# EasyEDA Pro project ph_module.eprj

# Schematic Schematic1
Board Name: Board1; Create Date: 2025-11-07; Page Name: P1; Project Name: ph模块; Schematic Name: Schematic1; Update Date: 2025-11-09; Company: 嘉立创EDA; Page Size: A4; Version: V1.0
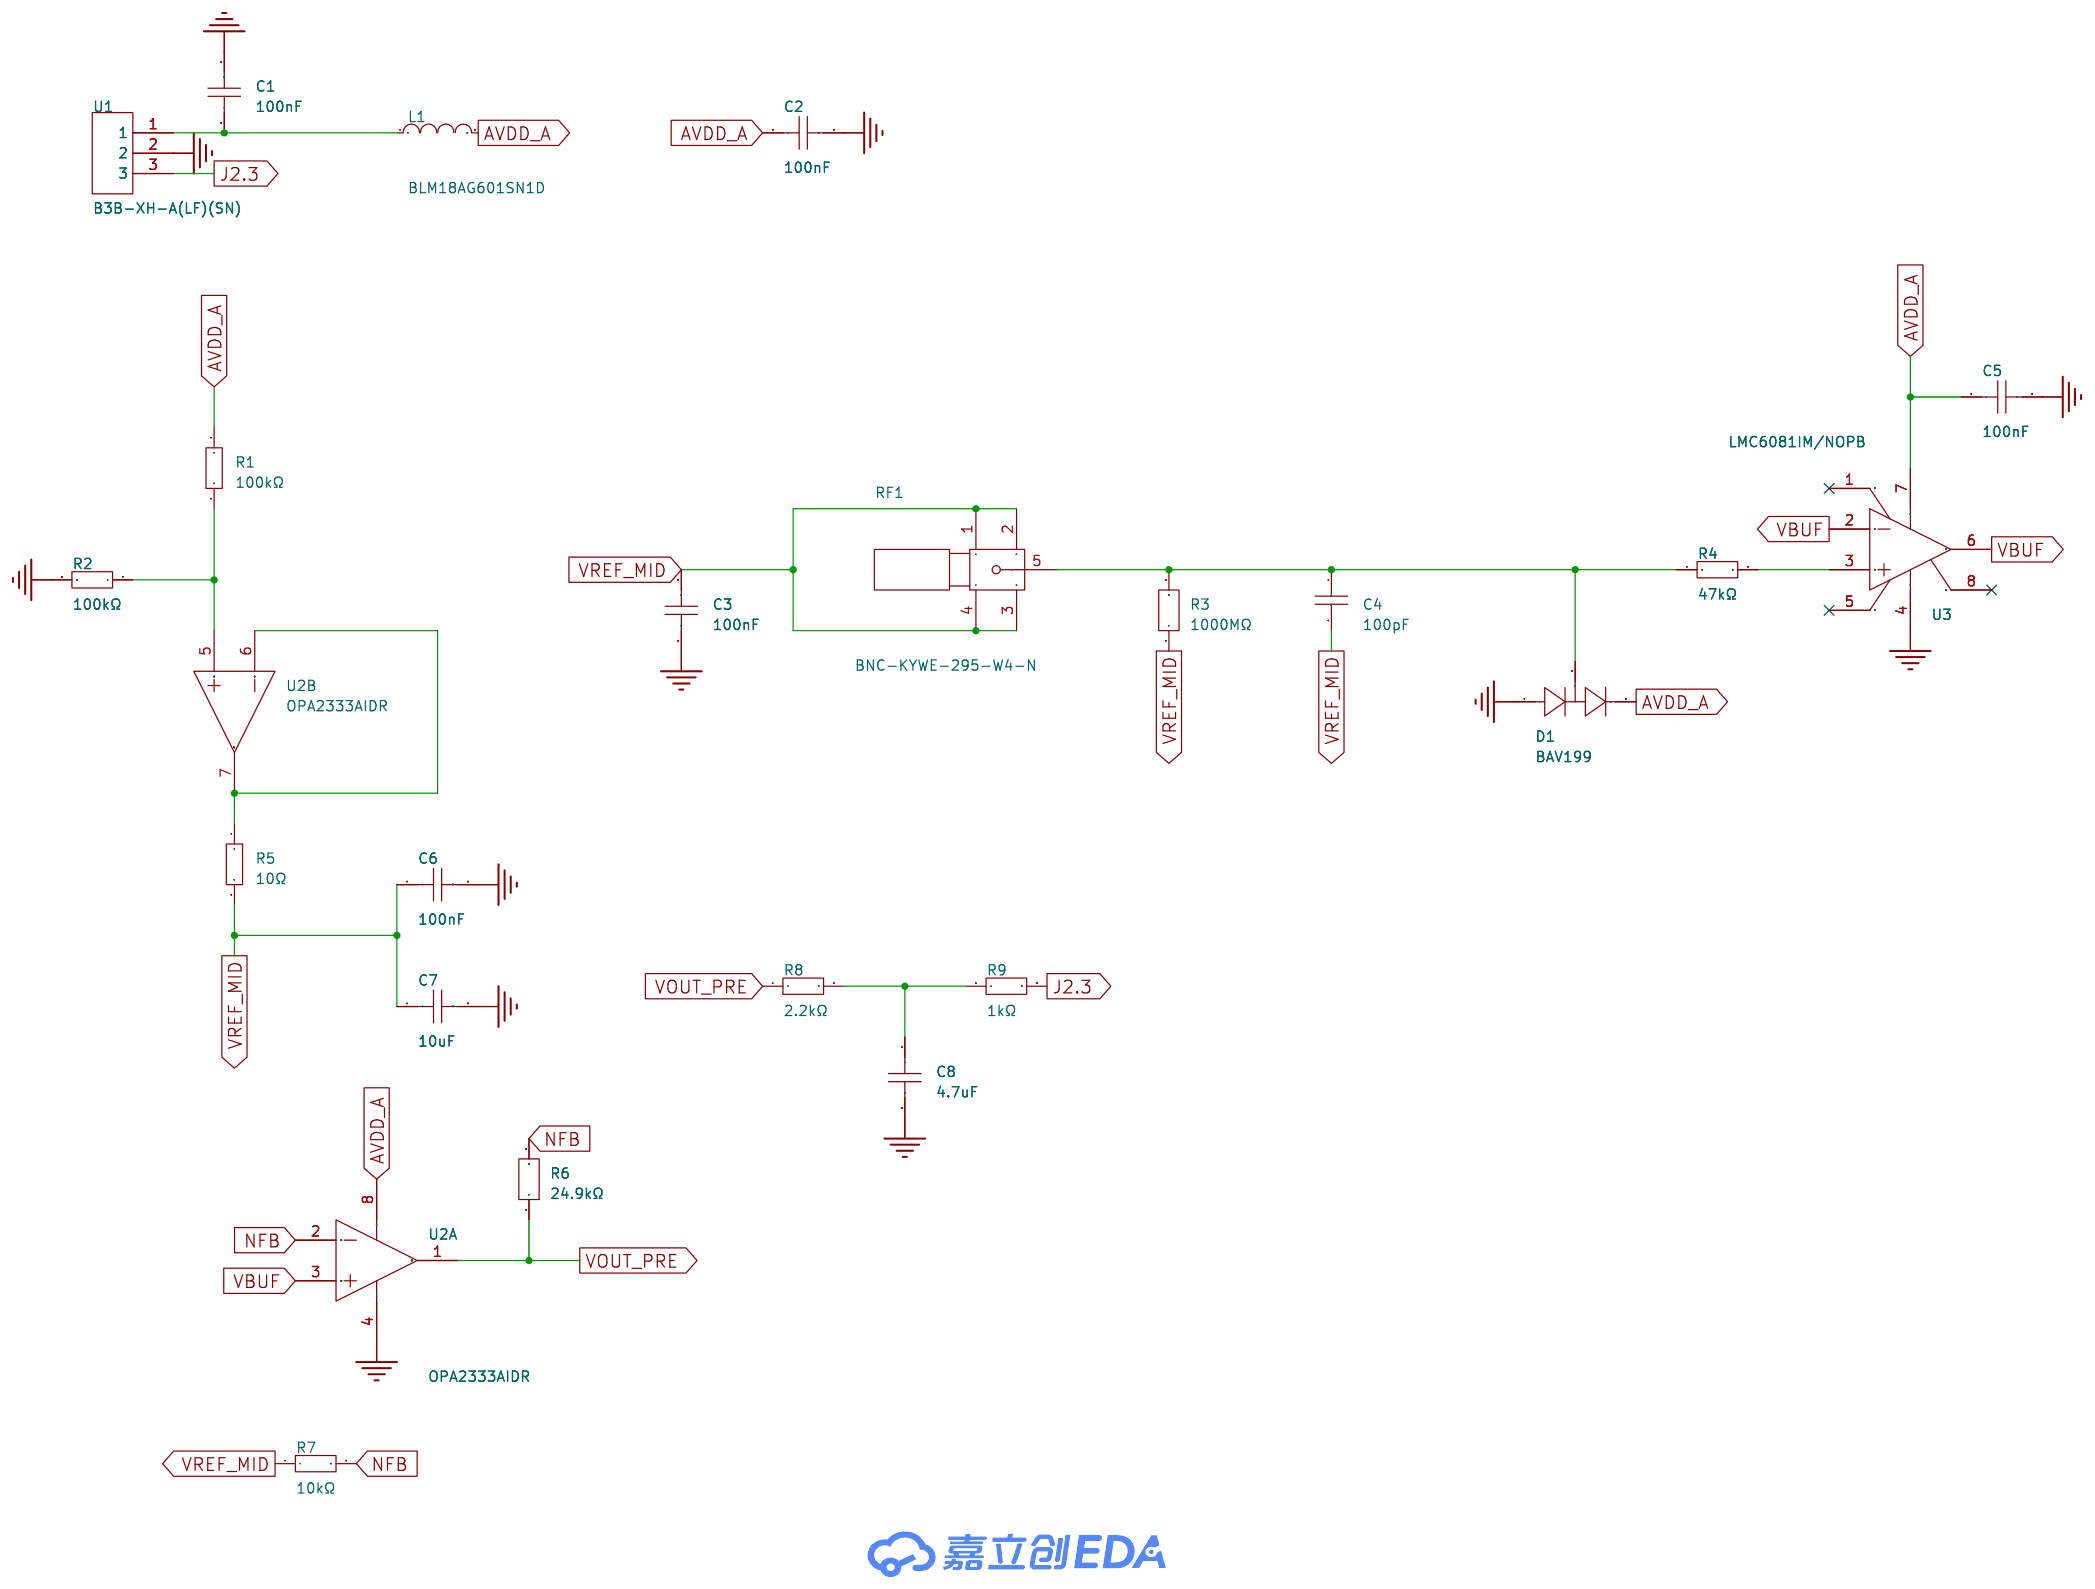
[diagram p0: schematic sheet]

## Parts
C1  100nF  [C0603]
C2  100nF  [C0603]
C3  100nF  [C0603]
C4  100pF  [C0603]
C5  100nF  [C0603]
C6  100nF  [C0603]
C7  10uF  [C0603]
C8  4.7uF  [C0603]
D1  BAV199  [SOT-23-3_L2.9-W1.3-P1.90-LS2.4-BR]
L1  BLM18AG601SN1D  [L0603]
R1  100kΩ  [R0603]
R2  100kΩ  [R0603]
R3  1000MΩ  [R1206]
R4  47kΩ  [R0603]
R5  10Ω  [R0603]
R6  24.9kΩ  [R0603]
R7  10kΩ  [R0603]
R8  2.2kΩ  [R0603]
R9  1kΩ  [R0603]
RF1  BNC-KYWE-295-W4-N  [BNC-TH_BNC-KYWE-295-W4-N]
U1  B3B-XH-A(LF)(SN)  [CONN-TH_3P-P2.50_A2501WV2-3P]
U2  OPA2333AIDR  [SOP-8_L4.9-W3.9-P1.27-LS6.0-BL]  (sections 1,2)
U3  LMC6081IM/NOPB  [SOIC-8_L4.9-W3.9-P1.27-LS6.0-BL]

## Library data of the parts
C1-C3 C5 C6 = CC0603KRX7R9BB104: LCSC Part Name: 100nF ±10% 50V; Supplier Part: C14663; Manufacturer: YAGEO(国巨); Supplier Footprint: 0603; Datasheet: https://item.szlcsc.com/datasheet/CC0603KRX7R9BB104/15331.html; Supplier: LCSC; Tolerance: ±10%; Voltage Rating: 50V; Temperature Coefficient: X7R
C4 = CL10C101JB8NNNC: LCSC Part Name: 100pF ±5% 50V; Supplier Part: C14858; Manufacturer: SAMSUNG(三星); Supplier Footprint: 0603; JLCPCB Part Class: 基础库; Datasheet: https://item.szlcsc.com/datasheet/CL10C101JB8NNNC/15530.html; Supplier: LCSC; Tolerance: ±5%; Voltage Rating: 50V; Temperature Coefficient: C0G
C7 = CL10A106KP8NNNC: LCSC Part Name: 10uF ±10% 10V; Supplier Part: C19702; Manufacturer: SAMSUNG(三星); Supplier Footprint: 0603; JLCPCB Part Class: 基础库; Datasheet: https://item.szlcsc.com/datasheet/CL10A106KP8NNNC/20411.html; Supplier: LCSC; Tolerance: ±10%; Voltage Rating: 10V; Temperature Coefficient: X5R
C8 = CL10A475KO8NNNC: LCSC Part Name: 4.7uF ±10% 16V; Supplier Part: C19666; Manufacturer: SAMSUNG(三星); Supplier Footprint: 0603; JLCPCB Part Class: 基础库; Datasheet: https://item.szlcsc.com/datasheet/CL10A475KO8NNNC/20375.html; Supplier: LCSC; Tolerance: ±10%; Voltage Rating: 16V; Temperature Coefficient: X5R
D1 = BAV199: Supplier Part: C699080; Manufacturer: YANGJIE(扬杰); Supplier Footprint: SOT-23(TO-236); JLCPCB Part Class: 扩展库; Datasheet: https://item.szlcsc.com/datasheet/BAV199/733772.html; Supplier: LCSC; Diode Configuration: 1对串联式; Voltage - Forward(Vf@If): 1.25V@150mA; Voltage - DC Reverse(Vr): 100V; Current - Rectified: 215mA; Pd - Power Dissipation: 250mW; Reverse Leakage Current (Ir): 5nA@75V; Reverse Recovery Time (trr): 3us; Non-Repetitive Peak Forward Surge Current: 4A
L1 = BLM18AG601SN1D: LCSC Part Name: 单路 0603磁珠 阻抗600Ω@100MHz; Supplier Part: C19330; Manufacturer: muRata(村田); Supplier Footprint: 0603; JLCPCB Part Class: 扩展库; Datasheet: https://item.szlcsc.com/datasheet/BLM18AG601SN1D/20038.html; Supplier: LCSC; Impedance @ Frequency: 600Ω@100MHz; Tolerance: ±25%; DC Resistance(DCR): 380mΩ; Current Rating: 500mA; Number of Circuits: 1; Operating Temperature: -55℃~+125℃
R1 R2 = 0603WAF1003T5E: LCSC Part Name: 100kΩ ±1% 100mW 厚膜电阻; Supplier Part: C25803; Manufacturer: UNI-ROYAL(厚声); Supplier Footprint: 0603; JLCPCB Part Class: 基础库; Datasheet: https://item.szlcsc.com/datasheet/0603WAF1003T5E/26546.html; Supplier: LCSC; Type: 厚膜电阻; Tolerance: ±1%; Power(Watts): 100mW; Voltage-Supply(Max): 75V; Temperature Coefficient: ±100ppm/℃; Operating Temperature: -55℃~+155℃
R3 = CRHV1206AF1G00FKE5: LCSC Part Name: 厚膜电阻 1000MΩ ±1% 300mW; Supplier Part: C844672; Manufacturer: VISHAY(威世); Supplier Footprint: 1206; JLCPCB Part Class: 扩展库; Datasheet: https://atta.szlcsc.com/upload/public/pdf/source/20221018/DEF225B2698C10BDB93B3063AAF38A59.pdf; Supplier: LCSC; Type: 厚膜电阻; Tolerance: ±1%; Power(Watts): 300mW; Temperature Coefficient: ±100ppm/℃; Operating Temperature Range: -55℃~+155℃
R4 = 0603WAF4702T5E: LCSC Part Name: 47kΩ ±1% 100mW 厚膜电阻; Supplier Part: C25819; Manufacturer: UNI-ROYAL(厚声); Supplier Footprint: 0603; JLCPCB Part Class: 基础库; Datasheet: https://item.szlcsc.com/datasheet/0603WAF4702T5E/26562.html; Supplier: LCSC; Type: 厚膜电阻; Tolerance: ±1%; Power(Watts): 100mW; Voltage-Supply(Max): 75V; Temperature Coefficient: ±100ppm/℃; Operating Temperature: -55℃~+155℃
R5 = 0603WAF100JT5E: LCSC Part Name: 10Ω ±1% 100mW 厚膜电阻; Supplier Part: C22859; Manufacturer: UNI-ROYAL(厚声); Supplier Footprint: 0603; Datasheet: https://item.szlcsc.com/datasheet/0603WAF100JT5E/23586.html; Supplier: LCSC; Type: 厚膜电阻; Tolerance: ±1%; Power(Watts): 100mW; Voltage-Supply(Max): 75V; Temperature Coefficient: ±400ppm/℃; Operating Temperature: -55℃~+155℃
R6 = FRC0603F2492TS: LCSC Part Name: 24.9kΩ ±1% 100mW 厚膜电阻; Supplier Part: C2930080; Manufacturer: FOJAN(富捷); Supplier Footprint: 0603; JLCPCB Part Class: 扩展库; Supplier: LCSC; Type: 厚膜电阻; Tolerance: ±1%; Power(Watts): 100mW; Voltage-Supply(Max): 75V; Temperature Coefficient: ±100ppm/℃; Operating Temperature: -55℃~+155℃
R7 = 0603WAF1002T5E: LCSC Part Name: 厚膜电阻 10kΩ ±1% 100mW; Supplier Part: C25804; Manufacturer: UNI-ROYAL(厚声); Supplier Footprint: 0603; JLCPCB Part Class: 基础库; Datasheet: https://item.szlcsc.com/datasheet/0603WAF1002T5E/26547.html; Supplier: LCSC; Type: 厚膜电阻; Tolerance: ±1%; Power(Watts): 100mW; Voltage-Supply(Max): 75V; Temperature Coefficient: ±100ppm/℃; Operating Temperature: -55℃~+155℃
R8 = 0603WAF2201T5E: LCSC Part Name: 2.2kΩ ±1% 100mW 厚膜电阻; Supplier Part: C4190; Manufacturer: UNI-ROYAL(厚声); Supplier Footprint: 0603; JLCPCB Part Class: 基础库; Datasheet: https://atta.szlcsc.com/upload/public/pdf/source/20200306/C422600_1E6D84923E4A46A82E41ADD87F860B5C.pdf; Supplier: LCSC; Type: 厚膜电阻; Tolerance: ±1%; Power(Watts): 100mW; Overload Voltage (Max): 75V; Temperature Coefficient: ±100ppm/℃; Operating Temperature Range: -55℃~+155℃
R9 = 0603WAF1001T5E: LCSC Part Name: 1kΩ ±1% 100mW 厚膜电阻; Supplier Part: C21190; Manufacturer: UNI-ROYAL(厚声); Supplier Footprint: 0603; JLCPCB Part Class: 基础库; Datasheet: https://atta.szlcsc.com/upload/public/pdf/source/20200306/C422600_1E6D84923E4A46A82E41ADD87F860B5C.pdf; Supplier: LCSC; Type: 厚膜电阻; Tolerance: ±1%; Power(Watts): 100mW; Overload Voltage (Max): 75V; Temperature Coefficient: ±100ppm/℃; Operating Temperature Range: -55℃~+155℃
RF1 = BNC-KYWE-295-W4-N: LCSC Part Name: 三件套 BNC; Supplier Part: C41416668; Manufacturer: SAMZO(三佐); Supplier Footprint: 插件; JLCPCB Part Class: 扩展库; Datasheet: https://atta.szlcsc.com/upload/public/pdf/source/20240926/7A198AA46D30119BE17D1D102091280F.pdf; Supplier: LCSC; Number of Ports: 1; RF Series: BNC
U1 = B3B-XH-A(LF)(SN): LCSC Part Name: 1x3P 间距:2.5mm 直插 系列:XH; Supplier Part: C144394; Manufacturer: JST; Supplier Footprint: 插件,P=2.5mm; JLCPCB Part Class: 扩展库; Datasheet: https://atta.szlcsc.com/upload/public/pdf/source/20180928/C265283_F9DFEEBDB2CF642B6BDFAB4B77BD2680.pdf; Supplier: LCSC; Pins Structure: 1x3P; Pitch: 2.5mm; Mounting Style: 直插; Reference Series: XH; Number of Pins: 3P; Number of Rows: 1; Number of PINs Per Row: 3; Current Rating (Max): 3A; Contact Material: 黄铜; Contact Plating: 锡; Operating Temperature Range: -25℃~+85℃; Rated Voltage (Max): 250V; Plastic Material: PA66; Flame Retardant Rating: UL94V-0; Supplementary Features: 打K脚; Colour: 白色; Z-Height of the Board: 7mm; X-Length of Bottom Edge on Board (Spacing Line): 9.9mm; Y-Width of Bottom Edge on Board: 5.75mm
U2 = OPA2333AIDR: Supplier Part: C38732; Manufacturer: TI(德州仪器); Supplier Footprint: SOP-8; JLCPCB Part Class: 扩展库; Datasheet: https://www.ti.com/cn/lit/gpn/opa2333; Supplier: LCSC; Number of Channels: 双路; Gain Bandwidth Product: 350kHz; Ib - Input Bias Current: 70pA; Vos - Input Offset Voltage: 2uV; Slew Rate: 0.16V/us; Operating Temperature: -40℃~+125℃
U3 = LMC6081IM/NOPB: Supplier Part: C2865616; Manufacturer: TI(德州仪器); Supplier Footprint: SOIC-8; JLCPCB Part Class: 扩展库; Datasheet: https://www.ti.com/cn/lit/gpn/lmc6081-mil; Supplier: LCSC; Number of Circuits: 单路; Gain Bandwidth Product(GBP): 1.3MHz; Current - Input Bias(Ib): 0.01pA; Slew Rate(SR): 1.5V/us; Output Current: 34mA; Operating Temperature: -40℃~+85℃

## Nets
AVDD_A: C2.1 C5.1 D1.2 L1.2 R1.1 U2.8(V+) U3.7(V+)
GND: C1.2 C2.2 C3.2 C5.2 C6.2 C7.2 C8.2 D1.1 R2.2 U1.2 U2.4(V-) U3.4(V-)
J2.3: R9.2 U1.3
NFB: R6.2 R7.2 U2.2(IN A-)
VBUF: U2.3(IN A+) U3.2(IN-) U3.6(OUT)
VOUT_PRE: R6.1 R8.1 U2.1(OUT A)
VREF_MID: C3.1 C4.2 C6.1 C7.1 R3.1 R5.2 R7.1 RF1.1 RF1.2 RF1.3 RF1.4
$1N388: C1.1 L1.1 U1.1
$1N1011: R1.2 R2.1 U2.5(IN B+)
$1N1476: C4.1 D1.3 R3.2 R4.1 RF1.5
$1N1950: R4.2 U3.3(IN+)
$1N2614: R5.1 U2.6(IN B-) U2.7(OUT B)
$1N3531: C8.1 R8.2 R9.1

Not connected (* = marked no-connect by the designer): U3 1(NC)* 5(NC)* 8(NC)*

# Board PCB1
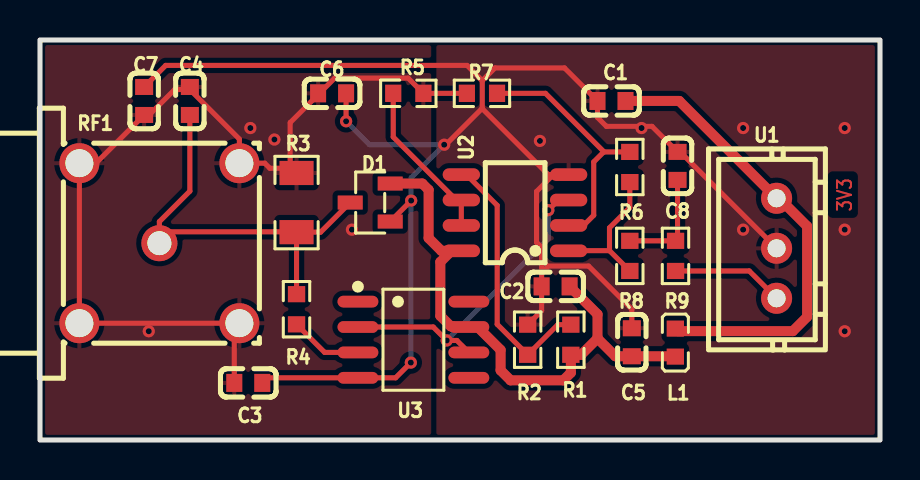
[diagram p1: board, top side]
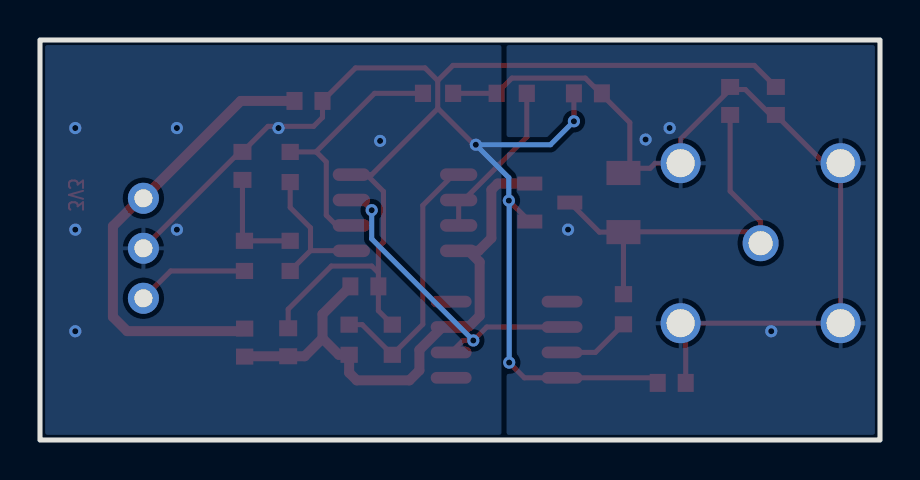
[diagram p2: board, bottom side, seen from below]

Outline 42 x 20 mm; copper layers: Top Layer, Bottom Layer. Coordinates in mm from the lower left corner of the outline.
Outline path: rectangle 0,20 42,0
Stack: Top Layer 0.035mm / Dielectric1 1.51mm FR4 er 4.5 / Bottom Layer 0.035mm

## Design rules (mm)
template: JLCPCB Capability(Two Layers Board)
spacing copperThickness1oz (default): track to track 0.102, other pairs 0.152 to 0.3
spacing copperThickness2oz: track to track 0.203, other pairs 0.152 to 0.3
track width copperThickness1oz (default): min 0.127, default 0.254, max 2.54
track width copperThickness2oz: min 0.203, default 0.254, max 2.54
differential pair differentialPair (default): width min 0.127, default 0.254, max 2.54; gap min 0.152, default 0.152
via viaSize (default): diameter min 0.5, default 0.61, max 10; hole min 0.3, default 0.305, max 6.3

## Placement (name value [footprint] x y rotation side)
C1  100nF  [C0603]  28.58 16.95 180 top
C2  100nF  [C0603]  25.78 7.68 180 top
C3  100nF  [C0603]  10.41 2.85 0 top
C4  100pF  [C0603]  7.49 16.95 90 top
C5  100nF  [C0603]  29.59 4.89 90 top
C6  100nF  [C0603]  14.61 17.33 0 top
C7  10uF  [C0603]  5.21 16.95 90 top
C8  4.7uF  [C0603]  31.88 13.71 90 top
D1  BAV199  [SOT-23-3_L2.9-W1.3-P1.90-LS2.4-BR]  16.51 11.87 0 top
L1  BLM18AG601SN1D  [L0603]  31.77 4.87 270 top
R1  100kΩ  [R0603]  26.54 5.01 90 top
R2  100kΩ  [R0603]  24.38 5.01 90 top
R3  1000MΩ  [R1206]  12.83 11.87 270 top
R4  47kΩ  [R0603]  12.83 6.54 270 top
R5  10Ω  [R0603]  18.42 17.33 0 top
R6  24.9kΩ  [R0603]  29.49 13.65 90 top
R7  10kΩ  [R0603]  22.1 17.33 0 top
R8  2.2kΩ  [R0603]  29.49 9.2 90 top
R9  1kΩ  [R0603]  31.78 9.2 270 top
RF1  BNC-KYWE-295-W4-N  [BNC-TH_BNC-KYWE-295-W4-N]  5.97 9.84 270 top
U1  B3B-XH-A(LF)(SN)  [CONN-TH_3P-P2.50_A2501WV2-3P]  36.83 9.59 270 top
U2  OPA2333AIDR  [SOP-8_L4.9-W3.9-P1.27-LS6.0-BL]  23.75 11.36 90 top
U3  LMC6081IM/NOPB  [SOIC-8_L4.9-W3.9-P1.27-LS6.0-BL]  18.67 5.01 270 top

## Footprints (pads in the part's own frame, mm; a bottom-side part is the same pattern mirrored in y, then rotated)
BNC-TH_BNC-KYWE-295-W4-N
  round 2 hole 1.4: 1(4,4) 2(4,-4) 3(-4,-4) 4(-4,4)
  round 1.8 hole 1.2: 5(0,0)
C0603
  rect 0.8x0.9 smd: 1(-0.7,0) 2(0.7,0)
CONN-TH_3P-P2.50_A2501WV2-3P
  round 1.55 hole 0.9: 1(-2.5,0) 2(0,0) 3(2.5,0)
L0603
  rect 0.8x0.864 smd: 1(-0.7,0) 2(0.7,0)
R0603
  rect 0.806x0.864 smd: 1(-0.753,0) 2(0.753,0)
R1206
  rect 1.208x1.701 smd: 1(-1.479,0) 2(1.479,0)
SOIC-8_L4.9-W3.9-P1.27-LS6.0-BL
  oval 0.588x2.045 smd: 1(-1.905,-2.772) 2(-0.635,-2.772) 3(0.635,-2.772) 4(1.905,-2.772) 5(1.905,2.772) 6(0.635,2.772) 7(-0.635,2.772) 8(-1.905,2.772)
SOP-8_L4.9-W3.9-P1.27-LS6.0-BL
  oval 0.63x1.865 smd: 1(-1.905,-2.683) 2(-0.635,-2.683) 3(0.635,-2.683) 4(1.905,-2.683) 5(1.905,2.683) 6(0.635,2.683) 7(-0.635,2.683) 8(-1.905,2.683)
SOT-23-3_L2.9-W1.3-P1.90-LS2.4-BR
  rect 1.25x0.7 smd: 1(1,-0.95) 2(1,0.95) 3(-1,0)

## Nets
As in the schematic.

Pads without a net: U3 1 5 8

## Via types
v1: diameter 0.61, hole 0.305, Top Layer to Bottom Layer, 17 vias

## Routing (per net, layer and track width the routed paths; a pad name or vN(x,y) marks a point on that pad's centre or on a via; arc(x,y) is an arc through that point)
AVDD_A: length 28.5
  Top Layer w0.5: 27.88,5.08 27.88,6.29 C2.1 ; 27.88,5.08 28.77,4.19 C5.1 31.75,4.19 L1.2 ; 27.88,5.08 27.06,4.26 R1.1 26.54,3.36 26.16,2.98 23.53,2.98 23.03,3.48 23.03,4.5 21.88,5.65 U3.7 20.66,5.65 20.63,5.68 20.54,5.68 20.02,6.21 20.02,8.9 20.57,9.46 ; 17.51,12.82 19.12,12.82 19.43,12.51 19.43,10.09 20.07,9.46 20.57,9.46 ; 20.57,9.46 U2.8
GND: length 89
  Top Layer w0.254: v1(20.21,14.76) 20.29,14.76 22.11,16.59 ; 22.11,17.97 22.11,16.59 ; 22.11,17.97 21.35,18.73 6.28,18.73 C7.2 ; 22.11,17.97 22.75,18.6 26.22,18.6 27.88,16.95 27.88,16.13 28.32,15.68 30.6,15.68 C8.2 32.01,14.41 U1.2 ; 22.11,16.59 22.11,16.57 25.41,13.27 25.67,13.27 ; 25.08,8.36 25.08,9.63 24.83,9.89 24.83,12.43 25.67,13.27 ; 25.08,8.36 25.42,8.7 27.43,8.7 29.59,6.54 C5.2 ; 25.08,8.36 C2.2 25.08,6.46 R2.2 ; C6.2 v1(15.31,15.94) ; 25.67,13.27 U2.4 ; C3.2 11.37,3.11 U3.4 17.78,3.11 v1(18.54,3.87) ; D1.1 v1(18.56,11.97)
  Bottom Layer w0.254: v1(18.54,3.87) 18.54,11.95 v1(18.56,11.97) 18.56,13.11 v1(20.21,14.76) 16.48,14.76 v1(15.31,15.94)
  vias: v1(25,14.95) v1(30.08,15.6) v1(35.16,15.6) v1(35.16,10.52) v1(40.24,15.6) v1(40.24,10.52) v1(40.24,5.44)
J2.3: length 5.6
  Top Layer w0.254: U1.3 35.46,8.45 R9.2
NFB: length 12.7
  Top Layer w0.254: R7.2 25.27,17.33 28.2,14.4 ; 28.2,14.4 R6.2 ; 28.2,14.4 28.19,14.4 27.69,13.9 27.69,11.24 27.18,10.73 U2.2
VBUF: length 15.9
  Top Layer w0.254: U2.3 25.92,12 v1(25.42,11.49) ; U3.2 19.66,5.65 v1(20.34,4.98) 20.84,4.98 U3.6
  Bottom Layer w0.254: v1(20.34,4.98) 25.42,10.06 v1(25.42,11.49)
VOUT_PRE: length 7.3
  Top Layer w0.254: R6.1 29.49,11.63 28.47,10.61 28.47,9.47 ; 28.47,9.47 26.44,9.47 U2.1 ; 28.47,9.47 R8.1
VREF_MID: length 46.5
  Top Layer w0.254: 7.36,17.52 6.73,17.52 5.46,16.25 C7.1 2.8,13.84 RF1.3 RF1.2 RF1.1 9.71,5.58 C3.1 ; 7.36,17.52 C4.2 ; 7.36,17.52 7.49,17.52 9.97,15.05 RF1.4 11.24,13.84 11.49,13.59 12.51,13.59 ; 12.51,13.59 12.59,13.59 R3.1 ; 12.51,13.59 12.51,15.87 13.91,17.27 ; R7.1 R5.2 18.41,18.09 14.73,18.09 13.91,17.27 ; 13.91,17.27 C6.1
  vias: v1(5.44,5.44) v1(10.52,15.6) v1(11.72,15.02) v1(15.6,10.52)
$1N388: length 23.1
  Top Layer w0.5: C1.1 31.96,16.95 U1.1 36.96,12.09 38.35,10.69 38.35,6.16 37.64,5.44 31.89,5.44 L1.1
$1N1011: length 13.3
  Top Layer w0.254: R1.2 25.89,5.77 R2.1 22.86,5.78 22.86,11.73 21.32,13.27 U2.5
$1N1476: length 20.3
  Top Layer w0.254: R3.2 14.03,10.39 D1.3 ; R3.2 12.81,10.41 5.97,10.41 ; R3.2 R4.1 ; C4.1 7.49,12.44 5.97,10.92 5.97,10.41 ; 5.97,10.41 RF1.5
$1N1950: length 3.7
  Top Layer w0.254: R4.2 14.23,4.38 U3.3
$1N2614: length 8.2
  Top Layer w0.254: U2.7 U2.6 20.96,12.1 20.71,12.1 17.66,15.15 R5.1
$1N3531: length 5.4
  Top Layer w0.254: R8.2 R9.1 31.88,10.06 C8.1

## Copper pours and planes (outline as drawn; the poured copper is in the pictures)
GND on Top Layer: -0.63,20.76 42.55,20.76 42.55,-0.57 -0.63,-0.57
GND on Bottom Layer: -1.52,21.14 43.94,21.14 43.94,-0.45 -1.52,-0.45
VREF_MID on Top Layer: -0.63,20.76 19.56,20.76 19.56,-0.57 -0.63,-0.57
VREF_MID on Bottom Layer: -0.51,20.38 18.67,20.38 18.67,-0.59 -0.51,-0.59

## Text on the board
Top Layer: 3V3
